# EAGLE schematic V1 (EAGLE 8.3.1)
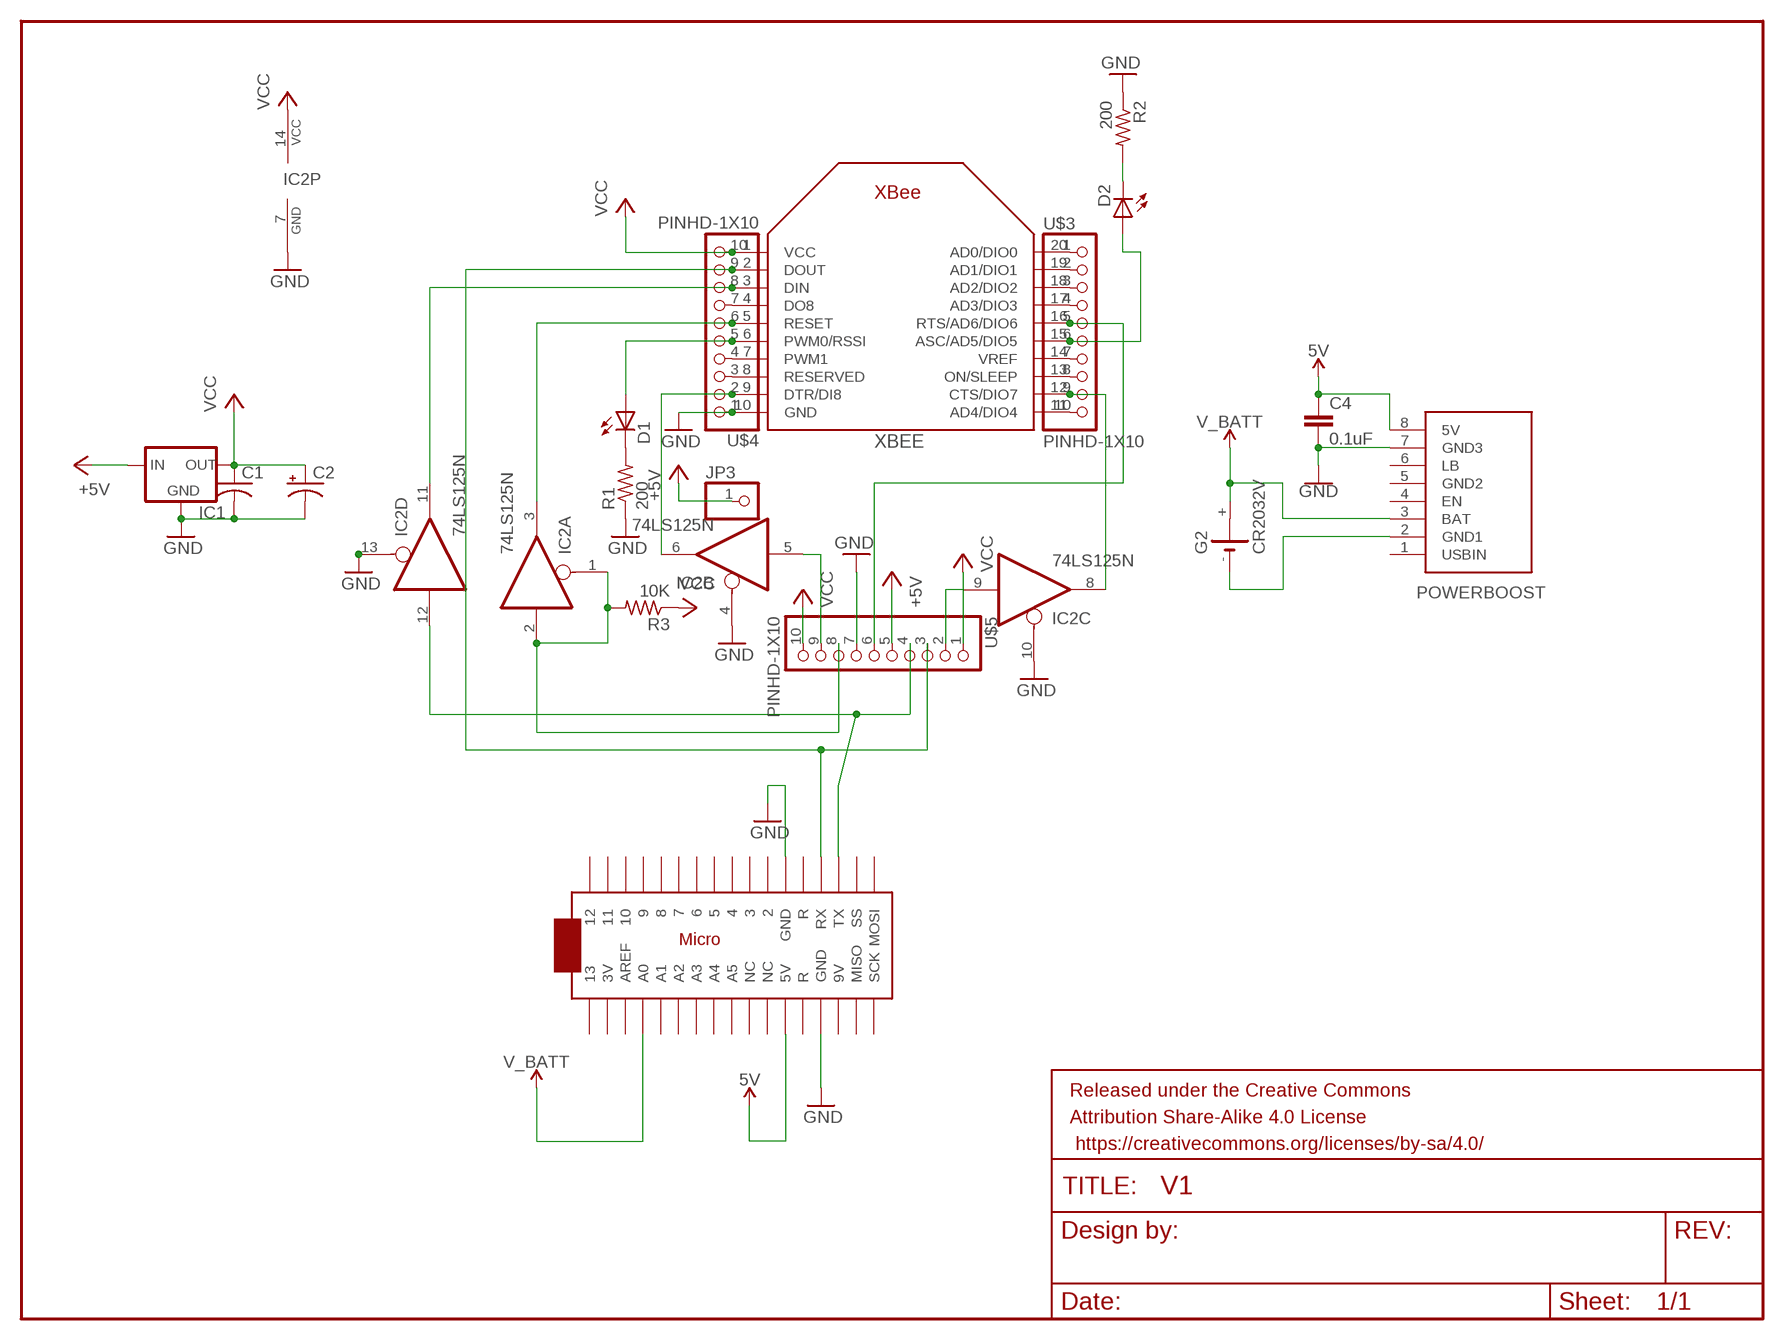
[diagram p0: schematic, sheet 1]

## Parts
C1  C-US025-025X050  [C025-025X050]
C2  CPOL-USE2.5-5  [E2,5-5]
C4  0.1uF  0.1UF-0402-16V-10%  [0402]
D1  LED3MM  [LED3MM]
D2  LED3MM  [LED3MM]
FRAME1  FRAME-LETTER  [CREATIVE_COMMONS]
G2  CR2032V  [CR2032V]
IC1  MC1700  [TO92]
IC2  74LS125N  [DIL14]
JP3  PINHD-1X1  [1X01]
R1  200  R-US_0207/10  [0207/10]
R2  200  R-US_0207/10  [0207/10]
R3  10K  R-US_0207/10  [0207/10]
U$1  POWERBOOST500C  [POWERBOOST500]
U$2  ARDUINOMICRO  [ARDUINOMICRO]
U$3  PINHD-1X10  [1X10-BIG]
U$4  PINHD-1X10  [1X10-BIG]
U$5  PINHD-1X10  [1X10-BIG]
XBEE  XBEE  [XBEE]

## Nets
5V: C4.1 U$1.8(5V) U$2.P$23(5V)
+5V: IC1.2(IN) JP3.1 U$5.5
GND: C1.2 C2.- C4.2 IC1.1(GND) IC2.4(B:OE) IC2.7(P:GND) IC2.10(C:OE) IC2.13(D:OE) R1.1 R2.1 U$1.7(GND3) U$2.P$12(GND) U$2.P$21(GND) U$4.1 U$5.7 XBEE.10(GND)
N$1: IC2.12(D:I) U$2.P$15(TX) U$5.4
N$2: IC2.11(D:O) U$4.8 XBEE.3(DIN)
N$3: IC2.5(B:I) U$5.9
N$4: IC2.8(C:O) U$3.9 XBEE.12(CTS/DIO7)
N$5: D2.K(C) R2.2
N$6: U$4.7 XBEE.4(DO8)
N$7: D1.A U$4.5 XBEE.6(PWM0/RSSI)
N$8: D1.K(C) R1.2
N$9: D2.A U$3.6 XBEE.15(ASC/AD5/DIO5)
N$10: IC2.6(B:O) U$4.2 XBEE.9(DTR/DI8)
N$11: U$4.3 XBEE.8(RESERVED)
N$12: U$4.4 XBEE.7(PWM1)
N$13: IC2.3(A:O) U$4.6 XBEE.5(RESET)
N$14: U$3.1 XBEE.20(AD0/DIO0)
N$15: U$3.2 XBEE.19(AD1/DIO1)
N$16: U$3.3 XBEE.18(AD2/DIO2)
N$17: U$3.4 XBEE.17(AD3/DIO3)
N$18: U$3.7 XBEE.14(VREF)
N$19: U$3.8 XBEE.13(ON/SLEEP)
N$20: U$3.10 XBEE.11(AD4/DIO4)
N$21: IC2.9(C:I) U$5.2
N$24: G2.- U$1.2(GND1)
RESET: IC2.1(A:OE) IC2.2(A:I) R3.2 U$5.8
RTS: U$3.5 U$5.6 XBEE.16(RTS/AD6/DIO6)
TX: U$2.P$14(RX) U$4.9 U$5.3 XBEE.2(DOUT)
V_BATT: G2.+ U$1.3(BAT) U$2.P$31(A0)
VCC: C1.1 C2.+ IC1.3(OUT) IC2.14(P:VCC) R3.1 U$4.10 U$5.1 U$5.10 XBEE.1(VCC)
Unconnected: G2.+@1(+) U$1.1(USBIN) U$1.4(EN) U$1.5(GND2) U$1.6(LB) U$2.P$1 U$2.P$2 U$2.P$3 U$2.P$4 U$2.P$5 U$2.P$6 U$2.P$7 U$2.P$8 U$2.P$9 U$2.P$10 U$2.P$11 U$2.P$13(R) U$2.P$16(SS) U$2.P$17(MOSI) U$2.P$18(SCK) U$2.P$19(MISO) U$2.P$20(9V) U$2.P$22(R) U$2.P$24(NC) U$2.P$25(NC) U$2.P$26(A5) U$2.P$27(A4) U$2.P$28(A3) U$2.P$29(A2) U$2.P$30(A1) U$2.P$32(AREF) U$2.P$33(3V) U$2.P$34

## Library data of the parts
C1 = rcl-ez:C-US: CAPACITOR, American symbol
C2 = rcl-ez:CPOL-US: POLARIZED CAPACITOR, American symbol
C4 = SparkFun-Capacitors:0.1UF: 0.1µF ceramic capacitors A capacitor is a passive two-terminal electrical component used to store electrical energy temporarily in an electric field.; PROD_ID: CAP-12416
D1 D2 = minimidi:LED: LED OSRAM: - CHIPLED LG R971, LG N971, LY N971, LG Q971, LY Q971, LO R971, LY R971 LH N974, LH R974 LS Q976, LO Q976, LY Q976 LO Q996 - Hyper CHIPLED LW Q18S LB Q993, LB Q99A, LB R99A - SideLED LS A670, LO A670, LY A670, LG A670, LP A670 LB A673, LV A673, LT A673, LW A673 LH A674 LY A675 LS A676, LA A676, LO A676, LY A676, LW A676 LS A679, LY A679, LG A679 - Hyper Micro SIDELED® LS Y876, LA Y876, LO Y876, LY Y876 LT Y87S - SmartLED LW L88C, LW L88S LB L89C, LB L89S, LG L890 LS L89K, LO L89K, LY L89K LS L896, LA L896, LO L896, LY L896 - TOPLED LS T670, LO T670, LY T670, LG T670, LP T670 LSG T670, LSP T670, LSY T670, LOP T670, LYG T670 LG T671, LOG T671, LSG T671 LB T673, LV T673, LT T673, LW T673 LH T674 LS T676, LA T676, LO T676, LY T676, LB T676, LH T676, LSB T676, LW T676 LB T67C, LV T67C, LT T67C, LS T67K, LO T67K, LY T67K, LW E67C LS E67B, LA E67B, LO E67B, LY E67B, LB E67C, LV E67C, LT E67C LW T67C LS T679, LY T679, LG T679 LS T770, LO T770, LY T770, LG T770, LP T770 LB T773, LV T773, LT T773, LW T773 LH T774 LS E675, LA E675, LY E675, LS T675 LS T776, LA T776, LO T776, LY T776, LB T776 LHGB T686 LT T68C, LB T68C - Hyper Mini TOPLED® LB M676 - Mini TOPLED Santana® LG M470 LS M47K, LO M47K, LY M47K Source: http://www.osram.convergy.de/
FRAME1 = SparkFun-Aesthetics:FRAME-LETTER: Schematic Frame - Letter Standard 8.5x11 US Letter frame
G2 = battery:CR2032V: LI BATTERY Varta
IC1 = ulink:MC1700: VOLTAGE REGULATOR
IC2 = 74xx-us:74*125: Quad bus BUFFER, 3-state
JP3 = digg:PINHD-1X1: PIN HEADER
R1-R3 = rcl-ez:R-US_: RESISTOR, American symbol
U$1 = jos-ph:POWERBOOST500C: Adafruit PowerBoost 500c https://www.adafruit.com/products/1944 *UNPROVEN*
U$2 = adafruit:ARDUINOMICRO
U$3-U$5 = ybox2:PINHD-1X10
XBEE = ulink:XBEE